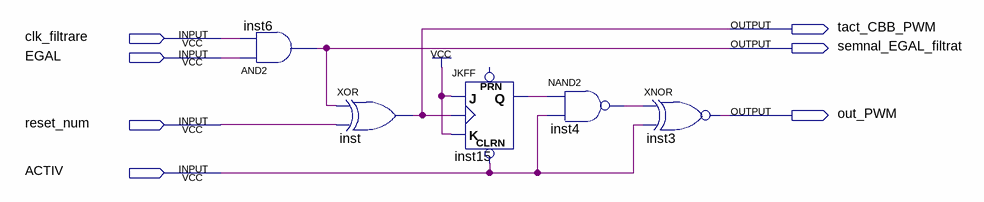
[diagram p0: schematic sheet]
// Quartus schematic generator_semnalPWM.bdf as structural Verilog: 5 symbols, 7 pins
module generator_semnalPWM (
  input  clk_filtrare,
  input  EGAL,
  input  reset_num,
  input  ACTIV,
  output tact_CBB_PWM,
  output semnal_EGAL_filtrat,
  output out_PWM
);

  wire inst4_out, inst15_q;

  and inst6 (semnal_EGAL_filtrat, EGAL, clk_filtrare);
  xor inst (tact_CBB_PWM, semnal_EGAL_filtrat, reset_num);
  JKFF inst15 (.CLRN(ACTIV), .K(1'b1), .J(1'b1), .CLK(tact_CBB_PWM), .Q(inst15_q));  // open: PRN
  nand inst4 (inst4_out, inst15_q, ACTIV);
  xnor inst3 (out_PWM, inst4_out, ACTIV);
endmodule
